# EAGLE design tc0xC_prod (EAGLE 9.6.2)

## Sheet 1 of 2
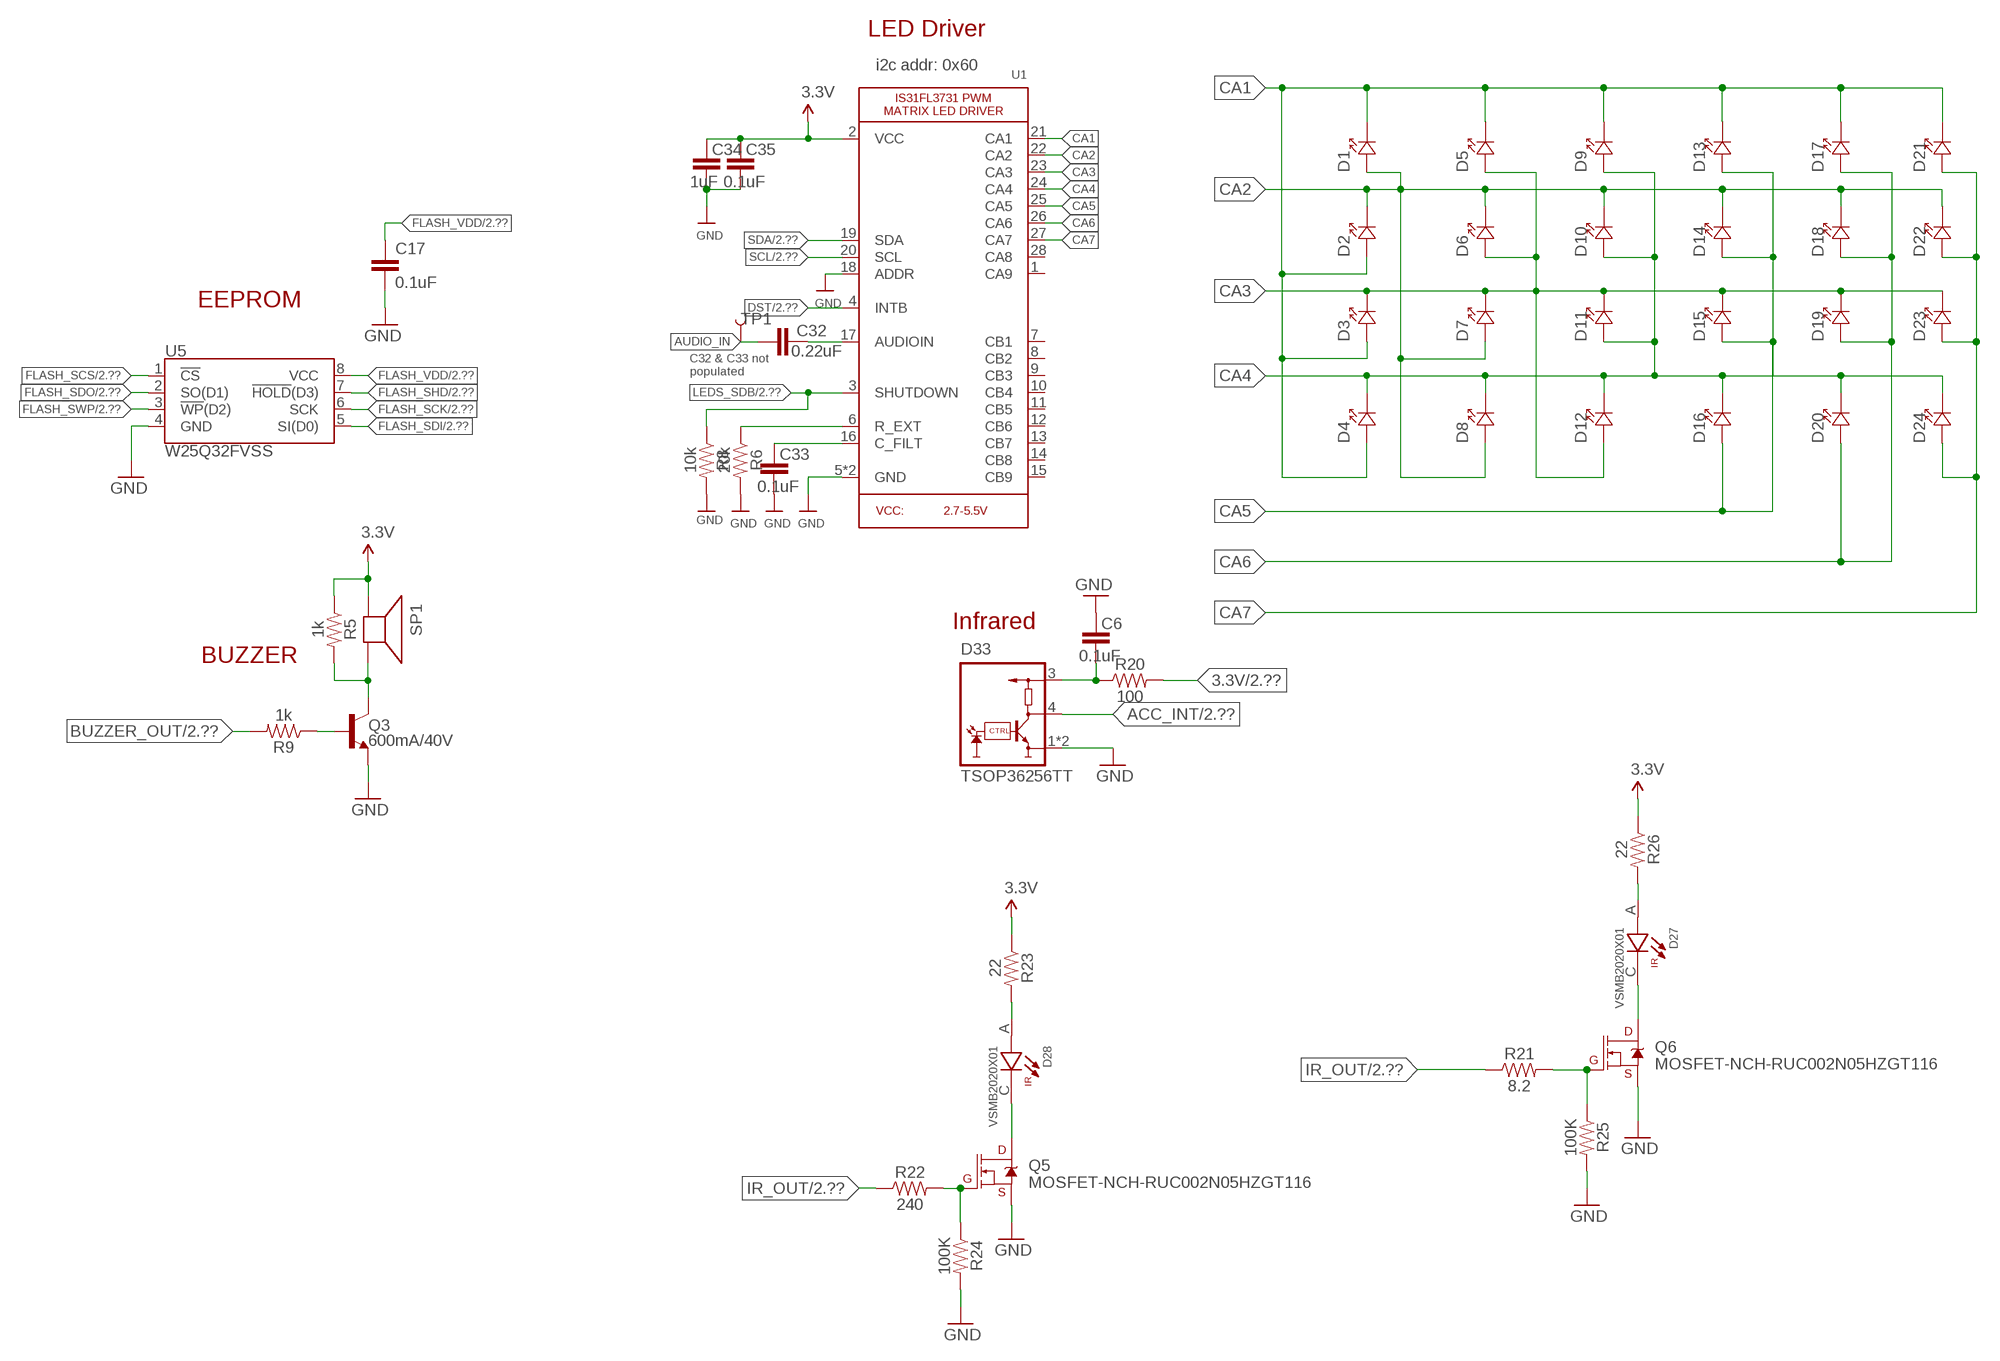
[diagram p0: schematic, sheet 1]

### Parts
C6  0.1uF  10PF-0603-50V-5%  [0603]
C17  0.1uF  0.1UF-0603-25V-(+80/-20%)  [0603]
C32  0.22uF  10PF-0603-50V-5%  [0603]
C33  0.1uF  10PF-0603-50V-5%  [0603]
C34  1uF  10PF-0603-50V-5%  [0603]
C35  0.1uF  10PF-0603-50V-5%  [0603]
D1  LED-603  [SMD-603]
D2  LED-603  [SMD-603]
D3  LED-603  [SMD-603]
D4  LED-603  [SMD-603]
D5  LED-603  [SMD-603]
D6  LED-603  [SMD-603]
D7  LED-603  [SMD-603]
D8  LED-603  [SMD-603]
D9  LED-603  [SMD-603]
D10  LED-603  [SMD-603]
D11  LED-603  [SMD-603]
D12  LED-603  [SMD-603]
D13  LED-603  [SMD-603]
D14  LED-603  [SMD-603]
D15  LED-603  [SMD-603]
D16  LED-603  [SMD-603]
D17  LED-603  [SMD-603]
D18  LED-603  [SMD-603]
D19  LED-603  [SMD-603]
D20  LED-603  [SMD-603]
D21  LED-603  [SMD-603]
D22  LED-603  [SMD-603]
D23  LED-603  [SMD-603]
D24  LED-603  [SMD-603]
D27  VSMB2020X01  [DIO_VSMB2020X01]
D28  VSMB2020X01  [DIO_VSMB2020X01]
D33  TSOP36256TT  [TSOP36256]
Q3  600mA/40V  TRANS_NPN-MMBT2222AL  [SOT23-3]
Q5  MOSFET-NCH-RUC002N05HZGT116  [SOT-23-3]
Q6  MOSFET-NCH-RUC002N05HZGT116  [SOT-23-3]
R5  1k  10KOHM-0603-1/10W-1%  [0603]
R6  20k  10KOHM-0603-1/10W-1%  [0603]
R8  10k  10KOHM-0603-1/10W-1%  [0603]
R9  1k  10KOHM-0603-1/10W-1%  [0603]
R20  100  10KOHM-0603-1/10W-1%  [0603]
R21  8.2  10KOHM-0603-1/10W-1%  [0603]
R22  240  10KOHM-0603-1/10W-1%  [0603]
R23  22  10KOHM-0603-1/10W-1%  [0603]
R24  100K  10KOHM-0603-1/10W-1%  [0603]
R25  100K  10KOHM-0603-1/10W-1%  [0603]
R26  22  10KOHM-0603-1/10W-1%  [0603]
SP1  SPEAKER/PS12  [PS12]
TP1  TEST-POINT3X5  [PAD.03X.05]
U1  IS31FL3731QFN  [QFN-28_4MM_0.4MM]
U5  W25Q32FVSS  [SOIC-8]

### Nets
3.3V: C34.1 C35.1 R5.1 R20.2 R23.1 R26.1 SP1.P$1(+) U1.2(VCC) ; also sheet 2
ACC_INT: D33.4(OUT) ; also sheet 2
AUDIO_IN: C32.1 TP1.P$1
BUZZER_OUT: R9.2 ; also sheet 2
CA1: D1.P$2(CATHODE-) D2.P$1(ANODE+) D3.P$1(ANODE+) D4.P$1(ANODE+) D5.P$2(CATHODE-) D9.P$2(CATHODE-) D13.P$2(CATHODE-) D17.P$2(CATHODE-) D21.P$2(CATHODE-) U1.21(CA1)
CA2: D1.P$1(ANODE+) D2.P$2(CATHODE-) D6.P$2(CATHODE-) D7.P$1(ANODE+) D8.P$1(ANODE+) D10.P$2(CATHODE-) D14.P$2(CATHODE-) D18.P$2(CATHODE-) D22.P$2(CATHODE-) U1.22(CA2)
CA3: D3.P$2(CATHODE-) D5.P$1(ANODE+) D6.P$1(ANODE+) D7.P$2(CATHODE-) D11.P$2(CATHODE-) D12.P$1(ANODE+) D15.P$2(CATHODE-) D19.P$2(CATHODE-) D23.P$2(CATHODE-) U1.23(CA3)
CA4: D4.P$2(CATHODE-) D8.P$2(CATHODE-) D9.P$1(ANODE+) D10.P$1(ANODE+) D11.P$1(ANODE+) D12.P$2(CATHODE-) D16.P$2(CATHODE-) D20.P$2(CATHODE-) D24.P$2(CATHODE-) U1.24(CA4)
CA5: D13.P$1(ANODE+) D14.P$1(ANODE+) D15.P$1(ANODE+) D16.P$1(ANODE+) U1.25(CA5)
CA6: D17.P$1(ANODE+) D18.P$1(ANODE+) D19.P$1(ANODE+) D20.P$1(ANODE+) U1.26(CA6)
CA7: D21.P$1(ANODE+) D22.P$1(ANODE+) D23.P$1(ANODE+) D24.P$1(ANODE+) U1.27(CA7)
DST: U1.4(INTB) ; also sheet 2
FLASH_SCK: U5.6(SCK) ; also sheet 2
FLASH_SCS: U5.1(!CS!) ; also sheet 2
FLASH_SDI: U5.5(SI(D0)) ; also sheet 2
FLASH_SDO: U5.2(SO(D1)) ; also sheet 2
FLASH_SHD: U5.7(!HOLD!(D3)) ; also sheet 2
FLASH_SWP: U5.3(!WP!(D2)) ; also sheet 2
FLASH_VDD: C17.1 U5.8(VCC) ; also sheet 2
GND: C6.1 C17.2 C33.2 C34.2 C35.2 D33.1(GND) D33.2(GND) Q3.2(E) Q5.2(S) Q6.2(S) R6.2 R8.2 R24.2 R25.2 U1.5(GND) U1.18(ADDR) U1.THERMAL(GND) U5.4(GND) ; also sheet 2
IR_OUT: R21.1 R22.1 ; also sheet 2
LEDS_SDB: R8.1 U1.3(SHUTDOWN) ; also sheet 2
N$1: C33.1 U1.16(C_FILT)
N$2: R6.1 U1.6(R_EXT)
N$3: Q3.3(C) R5.2 SP1.P$2(-)
N$5: Q6.1(G) R21.2 R25.1
N$6: Q5.1(G) R22.2 R24.1
N$11: C32.2 U1.17(AUDIOIN)
N$17: C6.2 D33.3(VS) R20.1
N$19: D28.C Q5.3(D)
N$20: D28.A R23.2
N$21: D27.C Q6.3(D)
N$22: D27.A R26.2
N$26: Q3.1(B) R9.1
SCL: U1.20(SCL) ; also sheet 2
SDA: U1.19(SDA) ; also sheet 2
Unconnected: U1.1(CA9) U1.7(CB1) U1.8(CB2) U1.9(CB3) U1.10(CB4) U1.11(CB5) U1.12(CB6) U1.13(CB7) U1.14(CB8) U1.15(CB9) U1.28(CA8)

### Notes on the sheet
- LED Driver
- i2c addr: 0x60
- EEPROM
- C32 & C33 not
  populated
- Infrared
- BUZZER

## Sheet 2 of 2
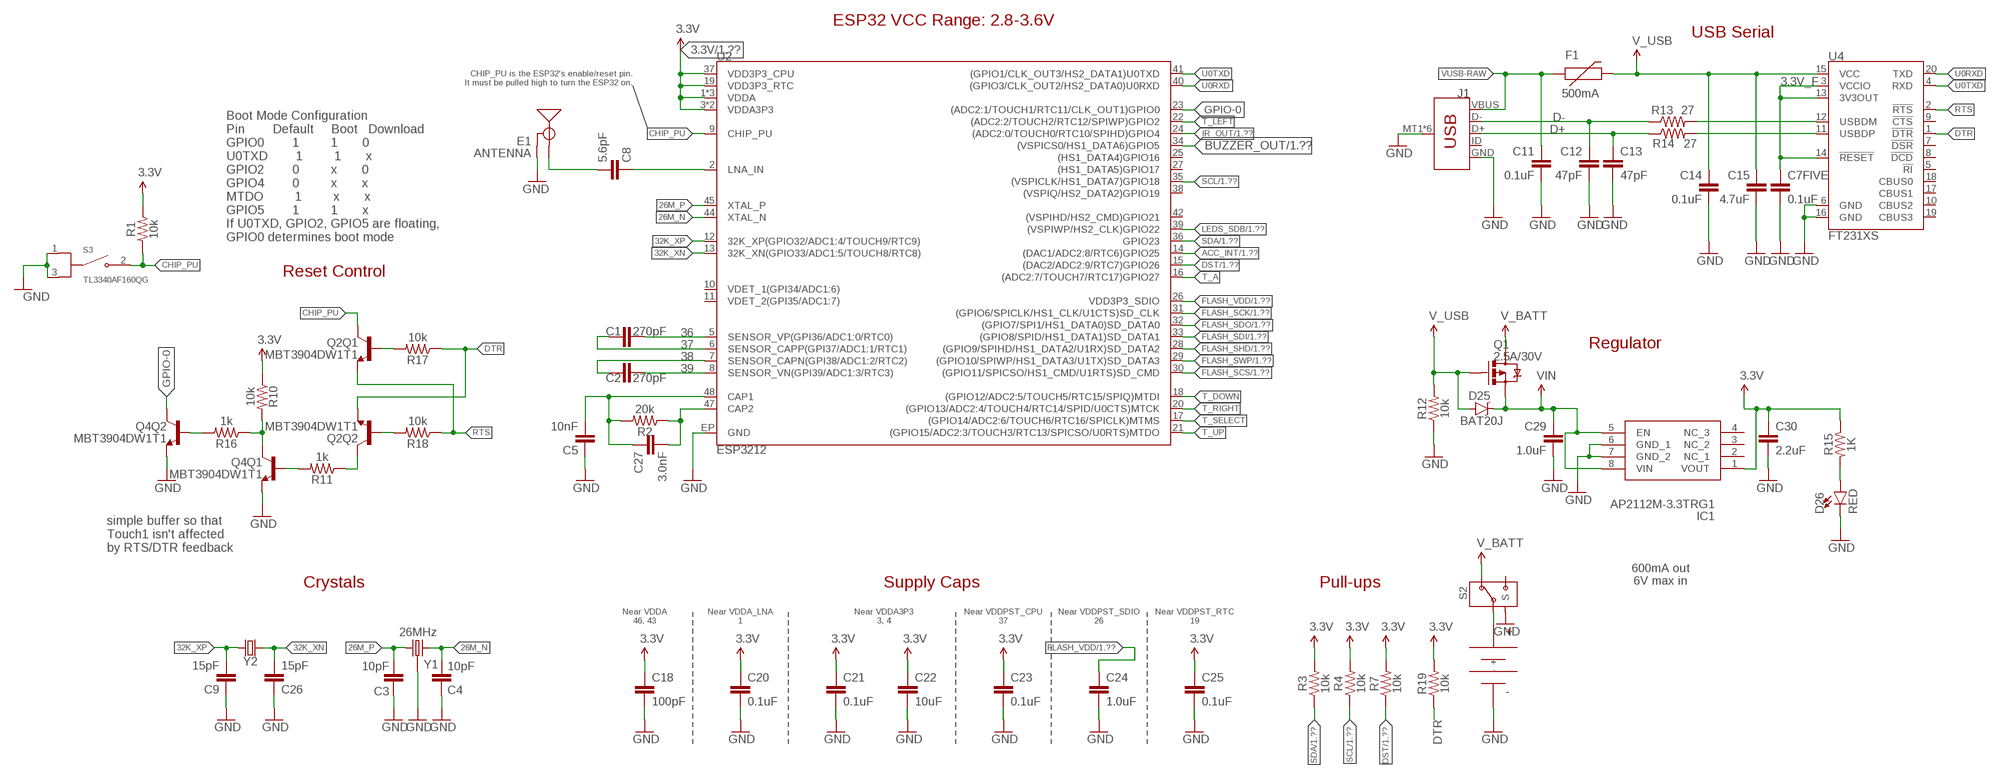
[diagram p1: schematic, sheet 2]

### Parts
C1  270pF  270PF-50V-5%(0603)  [0603]
C2  270pF  270PF-50V-5%(0603)  [0603]
C3  10pF  10PF-0603-50V-5%  [0603]
C4  10pF  10PF-0603-50V-5%  [0603]
C5  10nF  10NF-0603-50V-10%  [0603]
C7FIVE  0.1uF  0.1UF-0603-25V-(+80/-20%)  [0603]
C8  5.6pF  5.6PF-50V-5%(0603)  [0603]
C9  15pF  15PF-0603-50V-5%  [0603]
C11  0.1uF  0.1UF-0603-25V-(+80/-20%)  [0603]
C12  47pF  47PF-0603-50V-5%  [0603]
C13  47pF  47PF-0603-50V-5%  [0603]
C14  0.1uF  0.1UF-0603-25V-(+80/-20%)  [0603]
C15  4.7uF  0.1UF-0603-25V-(+80/-20%)  [0603]
C18  100pF  100PF-0603-50V-5%  [0603]
C20  0.1uF  0.1UF-0603-25V-(+80/-20%)  [0603]
C21  0.1uF  0.1UF-0603-25V-(+80/-20%)  [0603]
C22  10uF  10UF-0603-6.3V-20%  [0603]
C23  0.1uF  0.1UF-0603-25V-(+80/-20%)  [0603]
C24  1.0uF  1.0UF-0603-16V-10%  [0603]
C25  0.1uF  0.1UF-0603-25V-(+80/-20%)  [0603]
C26  15pF  15PF-0603-50V-5%  [0603]
C27  3.0nF  3.0NF-0603-50V-5%  [0603]
C29  1.0uF  1.0UF-0805-25V-(+80/-20%)  [0805]
C30  2.2uF  2.2UF-0603-10V-20%  [0603]
D25  BAT20J  DIODE-SCHOTTKY-BAT20J  [SOD-323]
D26  RED  LED-RED0603  [LED-0603@1]
E1  ANTENNA  ANTENNATRACE-TUNED  [TRACE_ANTENNA_2.4GHZ_25.7MM_TUNED]
F1  500mA  PTCSMD  [PTC-1206]
G2  KEYSTONE_2479  [KEYSTONE_2479]
IC1  AP2112M-3.3TRG1  [SOIC127P600X170-8N]
J1  USB_MICRO-B  [USB-MICROB-10118192]
Q1  2.5A/30V  MOSFET-PCHANNELDMG2307L  [SOT23-3@1]
Q2  MBT3904DW1T1  [SC70-6]
Q4  MBT3904DW1T1  [SC70-6]
R1  10k  10KOHM-1/10W-1%(0603)0603  [0603]
R2  20k  20KOHM-0603-1/10W-1%  [0603]
R3  10k  10KOHM-0603-1/10W-1%  [0603]
R4  10k  10KOHM-0603-1/10W-1%  [0603]
R7  10k  10KOHM-0603-1/10W-1%  [0603]
R10  10k  10KOHM-0603-1/10W-1%  [0603]
R11  1k  10KOHM-0603-1/10W-1%  [0603]
R12  10k  10KOHM-0603-1/10W-1%  [0603]
R13  27  27OHM1/10W1%(0603)0603-RES  [0603]
R14  27  27OHM1/10W1%(0603)0603-RES  [0603]
R15  1K  1KOHM-1/10W-1%(0603)  [0603]
R16  1k  10KOHM-0603-1/10W-1%  [0603]
R17  10k  10KOHM-0603-1/10W-1%  [0603]
R18  10k  10KOHM-0603-1/10W-1%  [0603]
R19  10k  10KOHM-0603-1/10W-1%  [0603]
S2  CUS-12B  [CUS-12_SPDT]
S3  TL3340AF160QG  [SW_TL3340AF160QG]
U2  ESP3212  [QFN48-0.4MM]
U4  FT231XS  [SSOP20_L]
Y1  26MHz  CRYSTAL-GROUNDED3.2X2.5  [CRYSTAL-SMD-3.2X2.5]
Y2  32.768kHz  FC-12M  [FC-12M]

### Nets
3.3V: C18.1 C20.1 C21.1 C22.1 C23.1 C25.1 C30.1 IC1.1(VOUT) R1.2 R3.2 R4.2 R7.2 R10.1 R15.1 R19.2 U2.1(VDDA) U2.3(VDDA3P3) U2.4(VDDA3P3) U2.19(VDD3P3_RTC) U2.37(VDD3P3_CPU) U2.43(VDDA) U2.46(VDDA) ; also sheet 1
3.3V_F: C7FIVE.1 U4.3(VCCIO) U4.13(3V3OUT) U4.14(!RESET)
26M_N: C4.2 U2.44(XTAL_N) Y1.3
26M_P: C3.2 U2.45(XTAL_P) Y1.1
32K_XN: C26.2 U2.13(32K_XN(GPIO33/ADC1:5/TOUCH8/RTC8)) Y2.2
32K_XP: C9.2 U2.12(32K_XP(GPIO32/ADC1:4/TOUCH9/RTC9)) Y2.1
36: C1.2 U2.5(SENSOR_VP(GPI36/ADC1:0/RTC0))
37: C1.1 U2.6(SENSOR_CAPP(GPI37/ADC1:1/RTC1))
38: C2.1 U2.7(SENSOR_CAPN(GPI38/ADC1:2/RTC2))
39: C2.2 U2.8(SENSOR_VN(GPI39/ADC1:3/RTC3))
ACC_INT: U2.14((DAC1/ADC2:8/RTC6)GPIO25) ; also sheet 1
BUZZER_OUT: U2.34((VSPICS0/HS1_DATA6)GPIO5) ; also sheet 1
CAP_10N: C5.2 C27.1 R2.2 U2.48(CAP1)
CHIP_PU: Q2.3(Q1:C) R1.1 S3.2(NO) U2.9(CHIP_PU)
D+: C13.1 J1.D+ R14.1
D-: C12.1 J1.D- R13.1
DST: R7.1 U2.15((DAC2/ADC2:9/RTC7)GPIO26) ; also sheet 1
DTR: Q2.1(Q2:E) R17.1 R19.1 U4.1(!DTR)
FLASH_SCK: U2.31((GPIO6/SPICLK/HS1_CLK/U1CTS)SD_CLK) ; also sheet 1
FLASH_SCS: U2.30((GPIO11/SPICSO/HS1_CMD/U1RTS)SD_CMD) ; also sheet 1
FLASH_SDI: U2.33((GPIO8/SPID/HS1_DATA1)SD_DATA1) ; also sheet 1
FLASH_SDO: U2.32((GPIO7/SPI1/HS1_DATA0)SD_DATA0) ; also sheet 1
FLASH_SHD: U2.28((GPIO9/SPIHD/HS1_DATA2/U1RX)SD_DATA2) ; also sheet 1
FLASH_SWP: U2.29((GPIO10/SPIWP/HS1_DATA3/U1TX)SD_DATA3) ; also sheet 1
FLASH_VDD: C24.1 U2.26(VDD3P3_SDIO) ; also sheet 1
GND: C3.1 C4.1 C5.1 C7FIVE.2 C9.1 C11.2 C12.2 C13.2 C14.2 C15.2 C18.2 C20.2 C21.2 C22.2 C23.2 C24.2 C25.2 C26.1 C29.2 C30.2 D26.C E1.GND E1.GND2(GND) G2.- IC1.6(GND_1) IC1.7(GND_2) J1.GND J1.MT1(SHIELD) J1.MT2(SHIELD) J1.MT3(SHIELD) J1.MT4(SHIELD) J1.P$1(SHIELD) J1.P$2(SHIELD) Q4.1(Q2:E) Q4.4(Q1:E) R12.1 S2.P$4(S) S2.P$5(S) S2.P$6(S) S2.P$7(S) S3.1(COM_1) S3.3(COM_2) U2.EP(GND) U4.6(GND) U4.16(GND) Y1.2(GND) Y1.4(GND) ; also sheet 1
GPIO-0: Q4.6(Q2:C) U2.23((ADC2:1/TOUCH1/RTC11/CLK_OUT1)GPIO0)
IR_OUT: U2.24((ADC2:0/TOUCH0/RTC10/SPIHD)GPIO4) ; also sheet 1
LEDS_SDB: U2.39((VSPIWP/HS2_CLK)GPIO22) ; also sheet 1
LNA_IN: C8.1 U2.2(LNA_IN)
N$4: C27.2 R2.1 U2.47(CAP2)
N$7: R13.2 U4.12(USBDM)
N$8: R14.2 U4.11(USBDP)
N$9: Q4.2(Q2:B) R16.2
N$10: Q2.5(Q1:B) R17.2
N$12: Q2.2(Q2:B) R18.2
N$13: Q4.3(Q1:C) R10.2 R16.1
N$14: Q4.5(Q1:B) R11.2
N$15: Q2.6(Q2:C) R11.1
N$16: G2.+ S2.P$2
N$18: D26.A R15.2
RTS: Q2.4(Q1:E) R18.1 U4.2(!RTS)
SCL: R4.1 U2.35((VSPICLK/HS1_DATA7)GPIO18) ; also sheet 1
SDA: R3.1 U2.36(GPIO23) ; also sheet 1
T_A: U2.16((ADC2:7/TOUCH7/RTC17)GPIO27)
T_DOWN: U2.18((GPIO12/ADC2:5/TOUCH5/RTC15/SPIQ)MTDI)
T_LEFT: U2.22((ADC2:2/TOUCH2/RTC12/SPIWP)GPIO2)
T_RIGHT: U2.20((GPIO13/ADC2:4/TOUCH4/RTC14/SPID/U0CTS)MTCK)
T_SELECT: U2.17((GPIO14/ADC2:6/TOUCH6/RTC16/SPICLK)MTMS)
T_UP: U2.21((GPIO15/ADC2:3/TOUCH3/RTC13/SPICSO/U0RTS)MTDO)
TRACE_ANT: C8.2 E1.ANT(SIGNAL)
U0RXD: U2.40((GPIO3/CLK_OUT2/HS2_DATA0)U0RXD) U4.20(TXD)
U0TXD: U2.41((GPIO1/CLK_OUT3/HS2_DATA1)U0TXD) U4.4(RXD)
V_BATT: Q1.3(D) S2.P$1
V_USB: C14.1 C15.1 D25.A F1.2 Q1.1(G) R12.2 U4.15(VCC)
VIN: C29.1 D25.C IC1.5(EN) IC1.8(VIN) Q1.2(S)
VUSB-RAW: C11.1 F1.1 J1.VBUS
Unconnected: IC1.2(NC_1) IC1.3(NC_2) IC1.4(NC_3) J1.ID S2.P$3 U2.10(VDET_1(GPI34/ADC1:6)) U2.11(VDET_2(GPI35/ADC1:7)) U2.25((HS1_DATA4)GPIO16) U2.27((HS1_DATA5)GPIO17) U2.38((VSPIQ/HS2_DATA2)GPIO19) U2.42((VSPIHD/HS2_CMD)GPIO21) U4.5(!RI) U4.7(!DSR) U4.8(!DCD) U4.9(!CTS) U4.10(CBUS2) U4.17(CBUS1) U4.18(CBUS0) U4.19(CBUS3)

### Notes on the sheet
- ESP32 VCC Range: 2.8-3.6V
- USB Serial
- CHIP_PU is the ESP32's enable/reset pin.
  It must be pulled high to turn the ESP32 on.
- Boot Mode Configuration
  Pin        Default     Boot   Download
  GPIO0        1         1       0
  U0TXD        1         1       x
  GPIO2        0         x       0
  GPIO4        0         x       x
  MTDO         1         x       x
  GPIO5        1         1       x
  If U0TXD, GPIO2, GPIO5 are floating, 
  GPIO0 determines boot mode
- Reset Control
- Regulator
- simple buffer so that
  Touch1 isn't affected
  by RTS/DTR feedback
- 600mA out
  6V max in
- Crystals | Supply Caps | Pull-ups
- Near VDDA
  46, 43
- Near VDDA_LNA
  1
- Near VDDA3P3
  3, 4
- Near VDDPST_CPU
  37
- Near VDDPST_SDIO
  26
- Near VDDPST_RTC
  19

## Library data of the parts
C1 C2 = esp32-thing-temp:270PF-50V-5%(0603): CAP-13339; PROD_ID: CAP-13339
C3 C4 = SparkFun-Capacitors:10PF: 10pF ceramic capacitors A capacitor is a passive two-terminal electrical component used to store electrical energy temporarily in an electric field.; PROD_ID: CAP-11812
C5 = SparkFun-Capacitors:10NF: 0.01uF/10nF/10,000pF ceramic capacitors A capacitor is a passive two-terminal electrical component used to store electrical energy temporarily in an electric field. CAP-09321; PROD_ID: CAP-00867
C6 C32-C35 = SparkFun-Capacitors:10PF: 10pF ceramic capacitors A capacitor is a passive two-terminal electrical component used to store electrical energy temporarily in an electric field.; PROD_ID: CAP-11812; VALUE: 10pF
C7FIVE C11 C14 C17 C20 C21 C23 C25 = SparkFun-Capacitors:0.1UF: 0.1µF ceramic capacitors A capacitor is a passive two-terminal electrical component used to store electrical energy temporarily in an electric field.; PROD_ID: CAP-00810
C8 = esp32-thing-temp:5.6PF-50V-5%(0603): CAP-12456; PROD_ID: CAP-12456
C9 C26 = SparkFun-Capacitors:15PF: 15pF ceramic capacitors A capacitor is a passive two-terminal electrical component used to store electrical energy temporarily in an electric field.; PROD_ID: CAP-07881
C12 C13 = SparkFun-Capacitors:47PF: 47pF ceramic capacitors A capacitor is a passive two-terminal electrical component used to store electrical energy temporarily in an electric field.; PROD_ID: CAP-08913
C15 = SparkFun-Capacitors:0.1UF: 0.1µF ceramic capacitors A capacitor is a passive two-terminal electrical component used to store electrical energy temporarily in an electric field.; PROD_ID: CAP-00810; VALUE: 0.1uF
C18 = SparkFun-Capacitors:100PF: 100pF/0.1nF ceramic capacitors A capacitor is a passive two-terminal electrical component used to store electrical energy temporarily in an electric field.; PROD_ID: CAP-07883
C22 = SparkFun-Capacitors:10UF: 10.0µF ceramic capacitors A capacitor is a passive two-terminal electrical component used to store electrical energy temporarily in an electric field.; PROD_ID: CAP-11015
C24 = SparkFun-Capacitors:1.0UF: 1µF ceramic capacitors A capacitor is a passive two-terminal electrical component used to store electrical energy temporarily in an electric field.; PROD_ID: CAP-00868
C27 = esp32-thing-temp:3.0NF: 3.0nF (3nF, 3000pF) ceramic capacitors A capacitor is a passive two-terminal electrical component used to store electrical energy temporarily in an electric field.; PROD_ID: CAP-13515
C29 = SparkFun-Capacitors:1.0UF: 1µF ceramic capacitors A capacitor is a passive two-terminal electrical component used to store electrical energy temporarily in an electric field.; PROD_ID: CAP-11625
C30 = SparkFun-Capacitors:2.2UF: 2.2µF ceramic capacitors A capacitor is a passive two-terminal electrical component used to store electrical energy temporarily in an electric field.; PROD_ID: CAP-07888
D1-D24 = Rob-Diodes:LED
D25 = SparkFun-DiscreteSemi:DIODE-SCHOTTKY: Schottky diodes in SFE's production catalog BAT20J 1A 23V 0.62Vf RB751 120mA 40V 0.37Vf PMEG4005EJ 0.5A 40V 0.42Vf MBRA140 1A 40V 0.5Vf B340A 3A 40V SMA; PROD_ID: DIO-11623
D26 = SparkFun-LED:LED-RED: Red SMD LED Used in manufacturing of most products at SparkFun 0603 - SMD 0603 package Forward Voltage: 1.9V Forward Current: 20mA Datasheet: [Product Link] <http://docs.avagotech.com/docs/AV02-0551EN> 0603 SMART - SMD 0603 SMART package ( more efficient and expensive) Forward Voltage: 1.8V Forward Current: 20mA Datasheet: [Product Link] <http://www.osram-os.com/Graphics/XPic2/00077099_0.pdf> 1206 - SMD 1206 package Forward Voltage: 2V Forward Current: 20mA Datasheet: [Product Link] <https://www.sparkfun.com/datasheets/DevTools/LilyPad/Q150OVS4.pdff> 1206 LilyPad - SMD 1206 LilyPad package Forward Voltage: 2V Forward Current: 20mA Datasheet: [Product Link] <https://www.sparkfun.com/datasheets/DevTools/LilyPad/Q150OVS4.pdf>; PROD_ID: DIO-00819
D27 D28 = VSMB2020X01:VSMB2020X01: 940 nm 100 mA ±12° Surface Mount High Speed Infrared Emitting Diode T&R Check availability <https://pricing.snapeda.com/parts/VSMB2020X01/Vishay%20Semiconductors/view-part?ref=eda>; AVAILABILITY: In Stock; DESCRIPTION: Infrared (IR) Emitter 940nm 1.35V 100mA 20mW/sr @ 100mA 24° 2-SMD, Gull Wing; MF: Vishay Semiconductors; MP: VSMB2020X01; PACKAGE: None; PRICE: None; PURCHASE-URL: https://pricing.snapeda.com/search/part/VSMB2020X01/?ref=eda
D33 = TSOP36256:TSOP36256: Récepteur Infrarouge 56khz 35m 45° Doc constructeur <http://geii/magasin/pdf/TSOP36256.pdf> GEII/IUT ANGERS Check availability <https://pricing.snapeda.com/parts/TSOP36256/Vishay%20Semiconductors/view-part?ref=eda>; AVAILABILITY: In Stock; DESCRIPTION: IR RCVR, 35M, 0.12MW/M2, TOP/SIDE SMD; Carrier Frequency:56kHz; IR Receiver Mounting Style:Top or Side View Surface Mount; Remote Control Code:NEC (Repetitive Pulse), NEC (Repetitive Data), Toshiba Micom Format, Sharp, RC-5, RC-6, R-2000, Sony; Transmission Range:35m; Automatic Gain Control (AGC) Type:AGC2; Detection Threshold / Sensitivity:0.12mW/m²; Directivity:45°; Supply Voltage Max:5.5V; Supply Voltage Min:2.7V; Operating Temperature Min:-25°C; Operating Temperature Max:85°C; Supply Current:1.3mA; Product Range:-; No. of Pins:4Pins; Operating Temperature Range:-25°C to +85°C; Supply Voltage Range:2.7V to 5.5V; Viewing Angle:45°; MF: Vishay Semiconductors; MP: TSOP36256; PACKAGE: None; PRICE: None; PURCHASE-URL: https://pricing.snapeda.com/search/part/TSOP36256/?ref=eda
E1 = esp32-thing-temp:ANTENNA: Chip antenna Chip antenna with ground or secondary connection. Common with larger metal RF connectors.
F1 = SparkFun-PowerIC:PTC: Resettable Fuse PTC Resettable Fuse. Spark Fun Electronics SKU : COM-08357; PROD_ID: RES-11150
G2 = keystone:KEYSTONE_2479
IC1 = AP2112M-3.3TRG1:AP2112M-3.3TRG1: LDO Voltage Regulators LDO CMOS HiCurr Source: Datasheet <https://www.diodes.com/assets/Datasheets/AP2112.pdf>; ARROW_PART_NUMBER: AP2112M-3.3TRG1; ARROW_PRICE-STOCK: https://www.arrow.com/en/products/ap2112m-3.3trg1/diodes-incorporated?region=nac; DESCRIPTION: LDO Voltage Regulators LDO CMOS HiCurr; HEIGHT: 1.7mm; MANUFACTURER_NAME: Diodes Inc.; MANUFACTURER_PART_NUMBER: AP2112M-3.3TRG1; MOUSER_PART_NUMBER: 621-AP2112M-3.3TRG1; MOUSER_PRICE-STOCK: https://www.mouser.co.uk/ProductDetail/Diodes-Incorporated/AP2112M-33TRG1?qs=5V6w%252Be2aIqa1YM8VADFBsQ%3D%3D
J1 = SparkFun-Connectors-new:USB_MICRO-B: USB Type Micro-B Connector Male/female and PTH/SMT variants SparkFun Products: SparkFun microB USB Breakout <https://www.sparkfun.com/products/12035> SparkFun USB microB Plug Breakout <https://www.sparkfun.com/products/10031> SparkFun ESP8266 Thing <https://www.sparkfun.com/products/13231>
Q1 = SparkFun-DiscreteSemi:MOSFET-PCHANNEL: Generic PMOSFET IRLML2244 - TRANS-11153 (SOT-23 -20V -4.3A) (1.Gate 2.Source 3.Drain) FQP27P06 - COM-10349 <http://www.sparkfun.com/products/10349> (TO-220 -60V -27A) (1.Gate 2.Source 3.Drain); PROD_ID: TRANS-11308
Q2 Q4 = esp32-thing-temp:MBT3904DW1T1: MBT3904DW1 Dual NPN Transistors The MBT3904W1 puts two general purpose 3904 NPN transistors in a single package. Datasheet <http://www.onsemi.com/pub_link/Collateral/MBT3904DW1T1-D.PDF>; PROD_ID: TRANS-13337
Q3 = SparkFun-DiscreteSemi:TRANS_NPN: NPN transistor Current controlled devices typically used to amplify current or used as a switch. BC547 - COM-08928 <http://www.sparkfun.com/products/8928> (TO-92 45V 100mA) (1.Collector 2.Base 3.Emitter) 2N3904 - COM-00521 <http://www.sparkfun.com/products/521> (TO-92 40V 200mA) (1.Emitter 2.Base 3.Collector) P2N2222A - COM-12852 <http://www.sparkfun.com/products/12852> (TO-92 40V 600mA) (1.Collector 2.Base 3.Emitter); PROD_ID: TRANS-08049
Q5 Q6 = Rob-DiscreteSemi:MOSFET-NCH
R1 = SparkFun-Resistors:10KOHM-1/10W-1%(0603): RES-00824; PROD_ID: RES-00824; VALUE: 10K
R2 = SparkFun-Resistors:20KOHM: 20kΩ resistor A resistor is a passive two-terminal electrical component that implements electrical resistance as a circuit element. Resistors act to reduce current flow, and, at the same time, act to lower voltage levels within circuits. - Wikipedia; PROD_ID: RES-09383
R3 R4 R7 R8 R10 R12 R17-R19 = SparkFun-Resistors:10KOHM: 10kΩ resistor A resistor is a passive two-terminal electrical component that implements electrical resistance as a circuit element. Resistors act to reduce current flow, and, at the same time, act to lower voltage levels within circuits. - Wikipedia; PROD_ID: RES-00824
R5 R6 R9 R11 R16 R20-R26 = SparkFun-Resistors:10KOHM: 10kΩ resistor A resistor is a passive two-terminal electrical component that implements electrical resistance as a circuit element. Resistors act to reduce current flow, and, at the same time, act to lower voltage levels within circuits. - Wikipedia; PROD_ID: RES-00824; VALUE: 10k
R13 R14 = SparkFun-Resistors:27OHM1/10W1%(0603): RES-09334; PROD_ID: RES-09334
R15 = SparkFun-Resistors:1KOHM-1/10W-1%(0603): RES-07856; PROD_ID: RES-07856
S2 = IDEO-Switches:CUS-12B
S3 = TL3340AF160QG:TL3340AF160QG: Check availability <https://pricing.snapeda.com/parts/TL3340AF160QG/E-Switch/view-part?ref=eda> Check availability <https://pricing.snapeda.com/parts/TL3340AF160QG/E-Switch/view-part?ref=eda>; AVAILABILITY: In Stock; DESCRIPTION: Tactile Switch SPST-NO Side Actuated Surface Mount, Right Angle; MF: E-Switch; MP: TL3340AF160QG; PACKAGE: None; PRICE: None; PURCHASE-URL: https://pricing.snapeda.com/search/part/TL3340AF160QG/?ref=eda
SP1 = adafruit:SPEAKER: SPEAKER Source: Buerklin Added PS12 (for part # PS1240 piezo) http://www.ladyada.net/library/pcb/eaglelibrary.html
TP1 = SparkFun-Connectors:TEST-POINT: SparkFun Test Points Bare copper test points for troubleshooting or In-Circuit-Testing. These are used by our Production team for verifying production board runs using pogo-pins on test beds. SparkFun Products: SparkFun LSM9DS1 Breakout <https://www.sparkfun.com/products/13284> SparkFun PSOC <https://www.sparkfun.com/products/13714> SparkFun Load Cell Amplifier <https://www.sparkfun.com/products/13879>
U1 = IDEO-ICs:IS31FL3731: IS31FL3731 PWM LED Matrix Driver
U2 = esp32-thing-temp:ESP3212; PROD_ID: IC-13338
U4 = SparkFun-DigitalIC:FT231X: FTDI FT231X Full Speed USB to Full-handshake UART This USB2.0 Full Speed IC offers a compact bridge to full handshake UART interfaces. The device is a UART, capable of operating up to 3MBaud, with low power consumption (8mA). The FT231X includes the complete FT-X series feature set and enables USB to be added into a system design quickly and easily over a UART interface.; PROD_ID: IC-11524
U5 = SparkFun-DigitalIC:W25Q32FV: Winbond W25Q32FV 32Mbit (4MB) Flash The W25Q32FV support the standard Serial Peripheral Interface (SPI), Dual/Quad I/O SPI as well as 2-clocks instruction cycle Quad Peripheral Interface (QPI). Datasheet <http://www.winbond.com/resource-files/w25q32fv%20revh%20091613.pdf>; PROD_ID: IC-13229
Y1 = things:CRYSTAL-GROUNDED; PROD_ID: XTAL-12454
Y2 = crystal:FC-12M: kHz RANGE CRYSTAL UNIT LOW PROFILE SMD Source: Epson Toyocom FC-12M.pdf

## Board
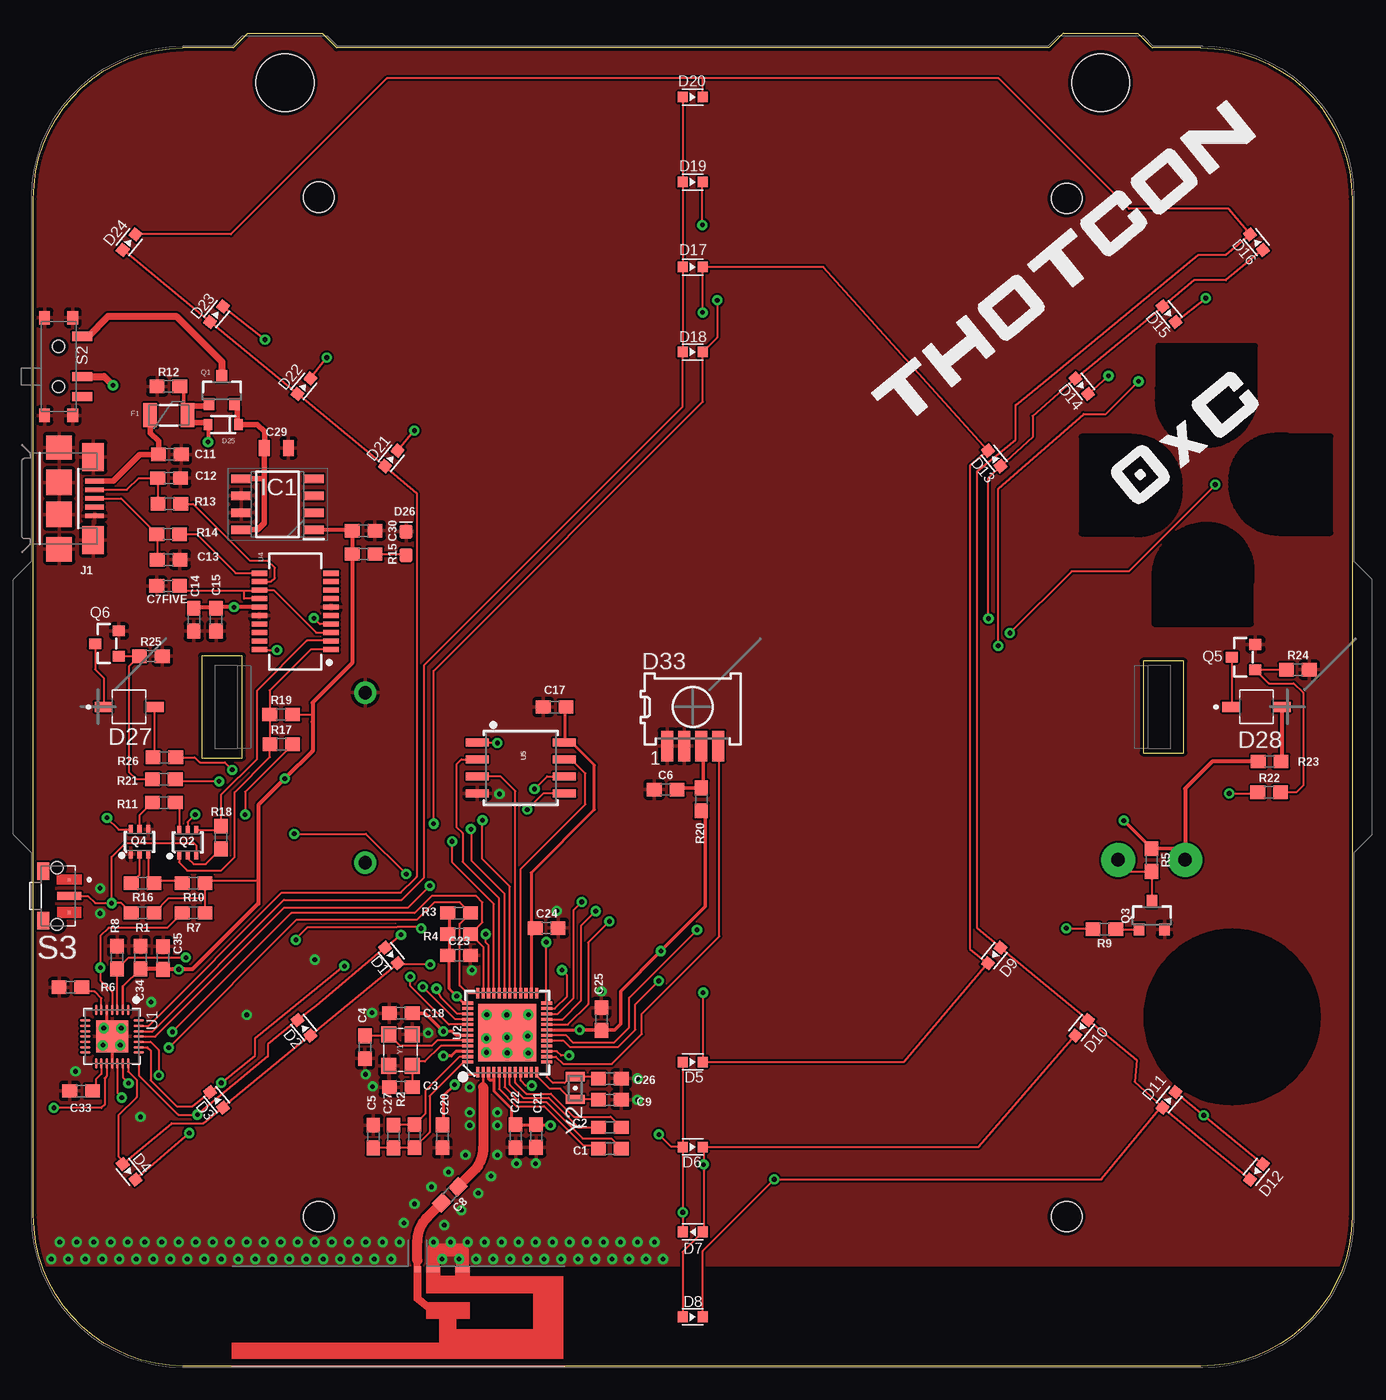
[diagram p2: board, top side]
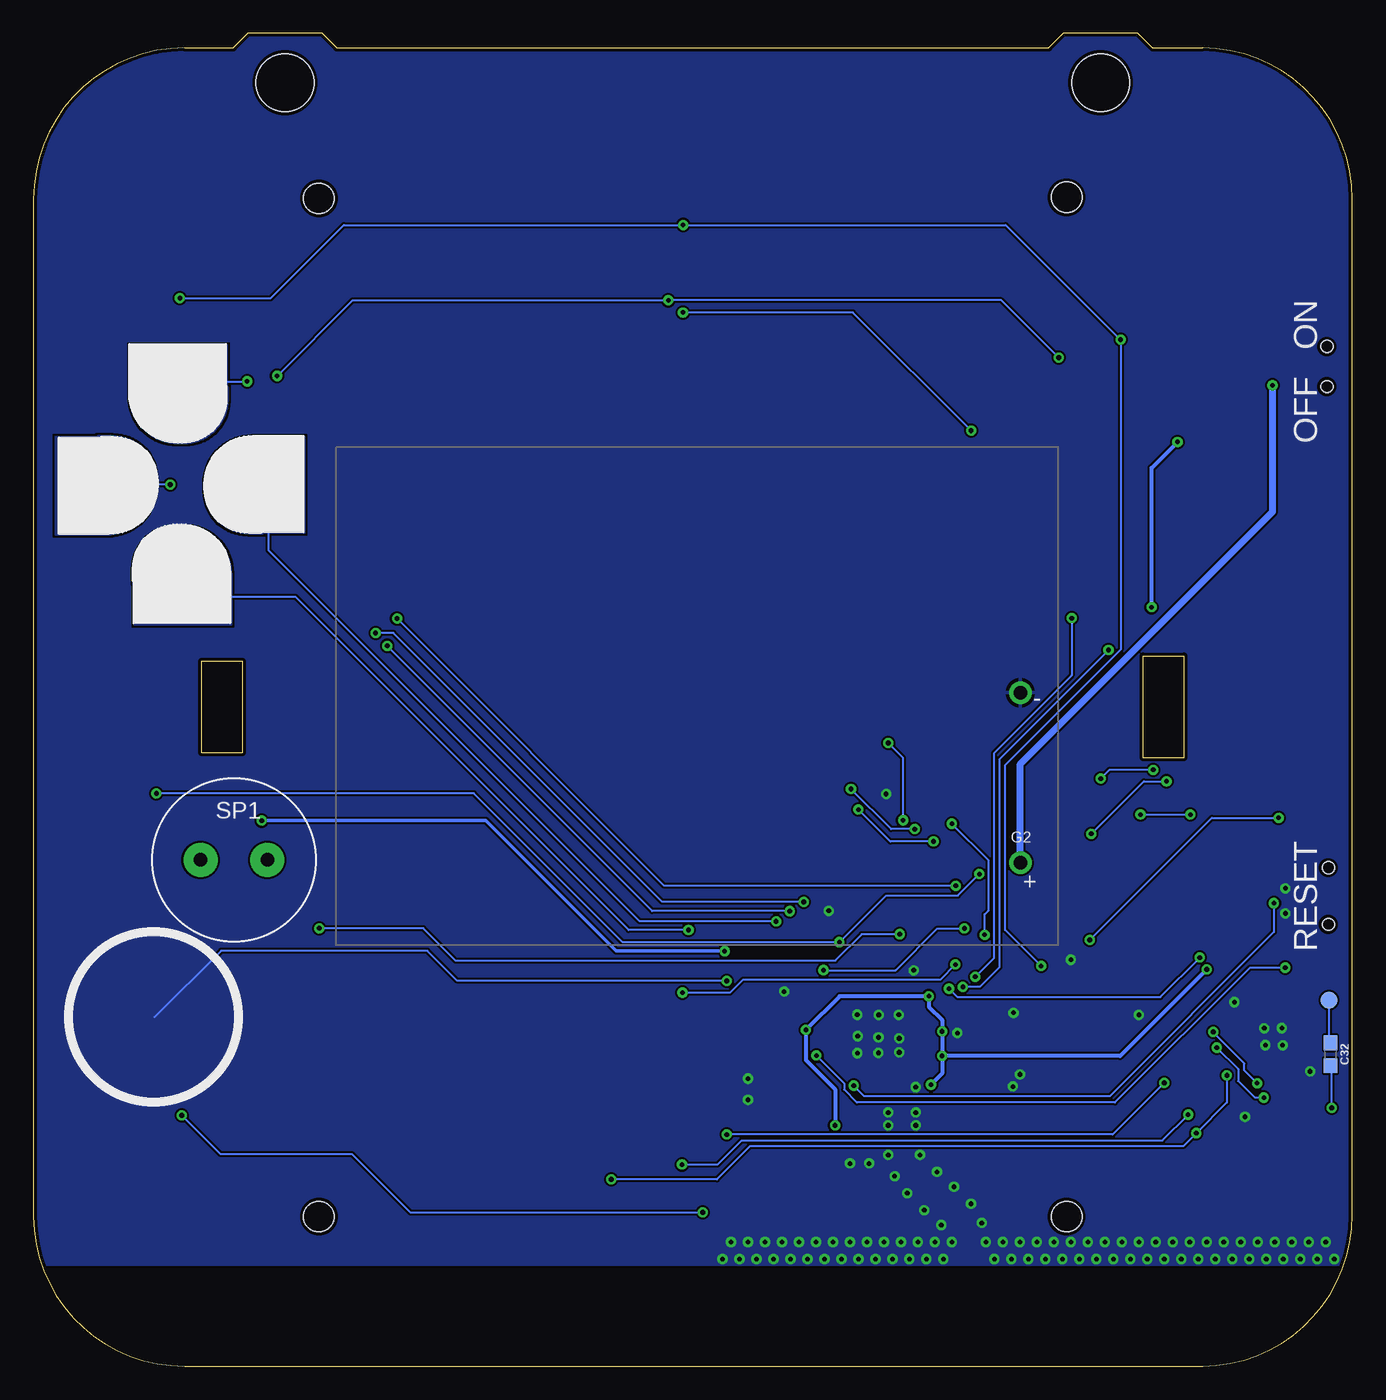
[diagram p3: board, bottom side, seen from below]

Size 98.55 x 99.63 mm. Coordinates in mm from the lower left corner, seen from the top.
Outline: 0,87.25 arc-90 11.18,98.55 14.93,98.55 16.02,99.63 21.58,99.63 22.66,98.55 75.89,98.55 76.97,99.63 82.54,99.63 83.62,98.55 87.25,98.55 arc-90 98.55,87.25 98.55,11.18 arc-90 87.25,0 11.18,0 arc-90 0,11.3 0,87.25
Outline: 82.93,45.85 85.98,45.85 85.98,52.7 82.93,52.7 82.93,45.85
Outline: 12.57,45.47 15.62,45.47 15.62,53.09 12.57,53.09 12.57,45.47
Copper layers (1*16): Top 0.035mm / dielectric 1.5mm / Bottom 0.035mm
Design rules "default *": minimum track width 6mil, minimum drill 0.35mm, track to track 6mil, track to pad 6mil, pad to pad 6mil, via to via 6mil, smd to smd 6mil, copper to edge 10mil, drill to drill 6mil, minimum pad ring 10mil, minimum via ring 8mil, stop-mask expansion 4mil, vias tented up to drill 0mil, thermal gap 10mil
Holes 2.29 mm at 21.34,87.38 77.22,87.3 77.22,11.18 21.34,11.18
Holes 4.32 mm at 18.8,95.95 79.76,95.95
tKeepout: area 97.5,35.7 to 98.8,37.9; area 19.4,85.5 to 23.2,89.3; area 19.4,9.3 to 23.2,13.1; area 75.3,9.3 to 79.1,13.1; area 75.3,85.5 to 79.1,89.3; area 46.1,91.7 to 49.3,98.1; area 49.3,91.7 to 52.4,98.1; area 46.1,85.4 to 49.3,91.7; area 49.3,85.4 to 52.4,91.7; area 46.1,79 to 49.3,85.4; area 49.3,79 to 52.4,85.4; area 46.1,72.7 to 49.3,79; 41 more areas
tRestrict: area 83.2,19.7 to 95.9,32.4; area 83.8,55.5 to 91,62.9; area 78.3,62.2 to 85.7,69.5; area 84,68.9 to 91.3,76.3; area 89.5,62.3 to 96.9,69.6; area 89.5,62.3 to 96.9,69.5

### Footprints (pad centres in the part's own frame; a part is rotated, then mirrored left to right if it is on the bottom)
0603 = smd 1.1 x 1: 1 -0.85,0; 2 0.85,0
0805 = smd 0.8 x 1.2: 1 -0.9,0; 2 0.9,0
SMD-603 = smd 0.8 x 0.8: P$1 -0.75,0; P$2 0.75,0
SOD-323 = smd 0.63 x 0.83: A 1.15,0; C -1.15,0
LED-0603@1 = smd 1 x 1: A 0,-0.877; C 0,0.877
DIO_VSMB2020X01 = smd 1.35 x 0.75: A 1.9,0; C -1.9,0
TSOP36256 = smd 0.914 x 2.286: 1 -1.905,-2.921; 2 -0.635,-2.921; 3 0.635,-2.921; 4 1.905,-2.921
TRACE_ANTENNA_2.4GHZ_25.7MM_TUNED = smd 0.46 x 0.46: ANT 0,0.23 | smd 1 x 0.46: GND -1.18,0.23; GND2 -3.38,0.23
PTC-1206 = smd 1 x 1.8: 1 -1.4,0; 2 1.4,0
KEYSTONE_2479 = drill 1 pad 1.676: + 51.15,6.15; - 51.15,18.85
SOIC127P600X170-8N = smd 1.5 x 0.65: 1 -2.7,1.905; 2 -2.7,0.635; 3 -2.7,-0.635; 4 -2.7,-1.905; 5 2.7,-1.905; 6 2.7,-0.635; 7 2.7,0.635; 8 2.7,1.905
USB-MICROB-10118192 = smd 0.35 x 1.4: D+ 0,2.65; D- -0.65,2.65; GND 1.3,2.65; ID 0.65,2.65; VBUS -1.3,2.65 | smd 1.8 x 1.9: MT1 -3.8,0; MT2 3.8,0 | smd 2.1 x 1.6: MT3 -3.1,2.54; MT4 3.1,2.54 | smd 1.9 x 1.9: P$1 -1.2,0; P$2 1.2,0
SOT23-3@1 = smd 0.8 x 0.9: 1 -0.95,-1; 2 0.95,-1; 3 0,1.1
SC70-6 = smd 0.3 x 0.66: 1 -0.65,-0.92; 2 0,-0.92; 3 0.65,-0.92; 4 0.65,0.92; 5 0,0.92; 6 -0.65,0.92
SOT23-3 = smd 0.8 x 0.9: 1 -0.95,-1; 2 0.95,-1; 3 0,1.1
SOT-23-3 = smd 0.972 x 0.8: 1 0.885,-0.95; 2 0.885,0.95; 3 -0.885,0
CUS-12_SPDT = smd 0.7 x 1.5: P$1 -2.25,1.75; P$2 0.75,1.75; P$3 2.25,1.75 | smd 1 x 0.8: P$4 -3.65,1.05; P$5 -3.65,-1.05; P$6 3.65,1.05; P$7 3.65,-1.05 | hole 0.9: -1.5,0; 1.5,0
SW_TL3340AF160QG = smd 0.2 x 0.2: 1 -1.225,0.9; 3 1.225,0.9 | smd 0.6 x 1.8: 2 0,0.9 | smd 1.3 x 0.9: S1 -1.85,-1.05; S2 1.85,-1.05 | hole 0.9: 2.125,0; -2.125,0
PS12 = drill 1 pad 2.54: P$1 -2.5,0; P$2 2.5,0
PAD.03X.05 = smd 1.27 x 1.27: P$1 0,0
QFN-28_4MM_0.4MM = smd 0.8 x 0.2: 1 -2,1.2; 2 -2,0.8; 3 -2,0.4; 4 -2,0; 5 -2,-0.4; 6 -2,-0.8; 7 -2,-1.2; 15 2,-1.2; 16 2,-0.8; 17 2,-0.4; 18 2,0; 19 2,0.4; 20 2,0.8; 21 2,1.2 | smd 0.2 x 0.8: 8 -1.2,-2; 9 -0.8,-2; 10 -0.4,-2; 11 0,-2; 12 0.4,-2; 13 0.8,-2; 14 1.2,-2; 22 1.2,2; 23 0.8,2; 24 0.4,2; 25 0,2; 26 -0.4,2; 27 -0.8,2; 28 -1.2,2 | smd 2.4 x 2.4: THERMAL 0,0
QFN48-0.4MM = smd 0.8 x 0.23: 1 -2.95,2.2; 2 -2.95,1.8; 3 -2.95,1.4; 4 -2.95,1; 5 -2.95,0.6; 6 -2.95,0.2; 7 -2.95,-0.2; 8 -2.95,-0.6; 9 -2.95,-1; 10 -2.95,-1.4; 11 -2.95,-1.8; 12 -2.95,-2.2; 25 2.95,-2.2; 26 2.95,-1.8; 27 2.95,-1.4; 28 2.95,-1; 29 2.95,-0.6; 30 2.95,-0.2; 31 2.95,0.2; 32 2.95,0.6; 33 2.95,1; 34 2.95,1.4; 35 2.95,1.8; 36 2.95,2.2 | smd 0.23 x 0.8: 13 -2.2,-2.95; 14 -1.8,-2.95; 15 -1.4,-2.95; 16 -1,-2.95; 17 -0.6,-2.95; 18 -0.2,-2.95; 19 0.2,-2.95; 20 0.6,-2.95; 21 1,-2.95; 22 1.4,-2.95; 23 1.8,-2.95; 24 2.2,-2.95; 37 2.2,2.95; 38 1.8,2.95; 39 1.4,2.95; 40 1,2.95; 41 0.6,2.95; 42 0.2,2.95; 43 -0.2,2.95; 44 -0.6,2.95; 45 -1,2.95; 46 -1.4,2.95; 47 -1.8,2.95; 48 -2.2,2.95 | smd 4.3 x 4.3: EP 0,0
SSOP20_L = smd 0.381 x 1.143: 1 -2.857,-2.68; 2 -2.223,-2.68; 3 -1.587,-2.68; 4 -0.953,-2.68; 5 -0.318,-2.68; 6 0.318,-2.68; 7 0.953,-2.68; 8 1.587,-2.68; 9 2.223,-2.68; 10 2.857,-2.68; 11 2.857,2.68; 12 2.223,2.68; 13 1.587,2.68; 14 0.953,2.68; 15 0.318,2.68; 16 -0.318,2.68; 17 -0.953,2.68; 18 -1.587,2.68; 19 -2.223,2.68; 20 -2.857,2.68
SOIC-8 = smd 0.61 x 1.702: 1 -1.905,-3.251; 2 -0.635,-3.251; 3 0.635,-3.251; 4 1.905,-3.251; 5 1.905,3.251; 6 0.635,3.251; 7 -0.635,3.251; 8 -1.905,3.251
CRYSTAL-SMD-3.2X2.5 = smd 1.2 x 1.1: 1 -1.175,-0.875; 2 1.175,-0.875; 3 1.175,0.875; 4 -1.175,0.875
FC-12M = smd 0.7 x 1.4: 1 -0.85,0; 2 0.85,0

### Placement (x,y rotation side)
C1  43.08,16.26 180 top
C2  43.08,17.84 0 top
C3  27.46,20.85 0 top
C4  24.78,23.84 90 top
C5  25.4,17.16 270 top
C6  47.24,43.1 0 top
C7FIVE  10.07,58.32 180 top
C8  31.13,12.8 225 top
C9  43.08,19.91 180 top
C11  10.2,68.16 0 top
C12  10.14,66.39 0 top
C13  10.1,60.29 0 top
C14  11.98,55.8 270 top
C15  13.65,55.8 270 top
C17  38.96,49.28 180 top
C18  27.46,26.38 180 top
C20  30.56,17.18 270 top
C21  37.57,17.2 270 top
C22  36.04,17.19 270 top
C23  31.81,30.7 0 top
C24  38.36,32.75 0 top
C25  42.45,25.94 90 top
C26  43.08,21.49 180 top
C27  26.91,17.17 90 top
C29  18.16,68.64 0 top
C30  24.67,62.45 0 top
C32  1.61,23.31 270 bottom
C33  3.56,20.57 180 top
C34  8,30.54 90 top
C35  9.68,30.51 90 top
D1  26.74,30.69 309.5 top
D2  20.21,25.3 129.5 top
D3  13.68,19.91 129.5 top
D4  7.15,14.52 309.5 top
D5  49.28,22.73 0 top
D6  49.28,16.38 0 top
D7  49.28,10.03 180 top
D8  49.28,3.68 0 top
D9  71.81,30.69 230.5 top
D10  78.34,25.3 230.5 top
D11  84.87,19.91 50.5 top
D12  91.4,14.52 230.5 top
D13  71.81,67.86 129.5 top
D14  78.34,73.25 309.5 top
D15  84.87,78.64 309.5 top
D16  91.4,84.03 129.5 top
D17  49.28,82.17 0 top
D18  49.28,75.82 0 top
D19  49.28,88.52 0 top
D20  49.28,94.87 0 top
D21  26.74,67.86 50.5 top
D22  20.21,73.25 50.5 top
D23  13.68,78.64 50.5 top
D24  7.15,84.03 50.5 top
D25  14.19,70.39 180 top
D26  27.84,61.5 0 top
D27  7.15,49.28 0 top
D28  91.41,49.28 0 top
D33  49.28,49.28 0 top
E1  28.7,7.45 180 top
F1  10.12,71.09 0 top
G2  75.95,31.5 0 bottom
IC1  18.25,64.43 180 top
J1  1.92,64.87 270 top
Q1  14.08,72.91 0 top
Q2  11.53,39.14 0 top
Q3  83.59,33.66 0 top
Q4  7.93,39.19 0 top
Q5  90.44,53 0 top
Q6  5.5,54.01 0 top
R1  8.16,33.88 0 top
R2  28.46,17.19 270 top
R3  31.81,33.88 180 top
R4  31.81,32.29 180 top
R5  83.57,37.83 270 top
R6  2.76,28.32 180 top
R7  11.97,33.88 0 top
R8  6.25,30.54 90 top
R9  80.04,32.66 180 top
R10  11.97,36.1 180 top
R11  9.75,42.13 180 top
R12  10.09,73.24 0 top
R13  10.17,64.46 0 top
R14  10.07,62.2 0 top
R15  24.67,60.71 0 top
R16  8.16,36.1 180 top
R17  18.52,46.49 0 top
R18  14.01,39.51 270 top
R19  18.51,48.71 0 top
R20  49.91,42.38 270 top
R21  9.75,43.88 180 top
R22  92.36,42.89 0 top
R23  92.39,45.2 0 top
R24  94.49,52.06 0 top
R25  8.77,53.08 0 top
R26  9.79,45.51 180 top
S2  1.89,74.73 270 top
S3  1.77,35.14 270 top
SP1  83.57,37.85 0 bottom
TP1  1.72,27.35 0 bottom
U1  5.88,24.64 270 top
U2  35.41,24.93 90 top
U4  19.57,56.42 90 top
U5  36.43,44.72 270 top
Y1  27.43,23.63 90 top
Y2  40.49,20.79 90 top

### Tracks (layer width: path | path; a pad name or v marks a point on that pad's centre or on a via)
3.3V  (via drill 0.35)
  Top 0.152: R19.2 20.86,48.71 20.86,48.16 | 16.8,36.26 12.98,36.26 R10.1 12.82,34.99 | R1.2 10.12,34.99 12.82,34.99 | 12.82,34.99 R7.2 | v14.86,44.57 14.3,45.13 12.43,45.13 12.05,45.51 R26.1
  Top 0.203: C34.1 6.68,28.37 U1.2
  Top 0.229: U2.1 33.21,21.82 32.26,21.82 v31.48,21.04 30.63,20.2 30.63,18.1 C20.1 | U2.43 31.56,24.73 31.27,25.02 v30.64,25.02 | U2.19 v40.82,25.13 | U2.46 31.58,23.53 31.23,23.19 v30.64,23.19 | U2.3 34.01,21.45 34.1,21.36 34.41,21.36 U2.4 34.41,20.56 35.72,19.26 35.72,18.36 C22.1 36.08,18 37.53,18 | 31.08,30.82 31.08,28.2 v31.63,27.65 32.15,27.13 U2.37 | 31.08,30.82 C23.1 | R3.2 31.08,33.76 31.08,32.4 | 31.08,32.4 31.08,30.82 | R4.2 31.08,32.4 | v38.64,18 37.53,18 | C21.1 37.53,18
  Top 0.254: SP1.P$1 85.23,38.68 R5.1 81.47,40.78 v81.48,40.78 | R20.2 50.23,41.21 50.23,34.35 v46.89,31.02 43.88,28 43.88,25.57 43.45,25.13 42.45,25.13 | v30.64,25.02 29.28,26.38 C18.1 | v40.82,25.13 42.45,25.13 | C25.1 42.45,25.13
  Top 0.305: C34.1 9.65,29.69 C35.1 v10.86,29.66 11.88,29.66 16.8,34.58 16.8,36.26 16.8,41.94 v18.79,43.92 20.86,45.99 20.86,48.16 20.86,49.59 23.82,52.55 R15.1 C30.1 23.75,62.52 IC1.1 | R23.1 88.1,45.2 86.07,43.17 SP1.P$1
  Bottom 0.152: v14.86,44.57 18.13,44.57 v18.79,43.92
  Bottom 0.254: v81.48,40.78 64.75,40.78 54.99,31.02 v46.89,31.02
  Bottom 0.305: v30.64,23.19 v30.64,25.02 30.64,25.87 31.63,26.86 v31.63,27.65 38.3,27.65 v40.82,25.13 40.82,22.88 38.64,20.7 v38.64,18 | v30.64,23.19 17.33,23.19 v10.86,29.66 | v30.64,23.19 30.64,21.88 v31.48,21.04
3.3V_F
  Top 0.152: C7FIVE.1 11.27,57.97 15.75,57.97 | 15.75,57.97 16.85,57.97 U4.13 17.94,58 21.12,54.83 U4.3 | U4.14 15.75,57.37 15.75,57.97
26M_N
  Top 0.152: U2.44 30.17,24.33 29.78,23.94 27.43,23.94 Y1.3 26.44,24.69 C4.2
26M_P
  Top 0.152: U2.45 30.42,23.93 29.26,22.77 28.63,22.77 Y1.1 C3.2
32K_XN
  Top 0.152: C26.2 42.09,21.64 Y2.2 40.17,21.64 39.7,21.16 38.81,21.16 38.36,21.61 U2.13
32K_XP
  Top 0.152: U2.12 37.61,21.7 38.58,20.73 39.38,20.73 40.17,19.94 Y2.1 42.2,19.94 C9.2
36
  Top 0.152: U2.5 34.81,20.72 36.1,19.43 38.16,19.43 41.08,16.51 41.98,16.51 C1.2
37
  Top 0.152: U2.6 35.21,20.86 36.32,19.75 38.32,19.75 41.05,17.02 41.66,17.02 | 41.66,17.02 | 41.66,17.02 43.17,17.02 C1.1
38
  Top 0.152: U2.7 35.61,21.03 36.59,20.05 38.49,20.05 40.7,17.84 C2.1
39
  Top 0.152: U2.8 36.01,21.18 36.84,20.36 38.66,20.36 40.39,18.64 43.14,18.64 C2.2
ACC_INT
  Top 0.152: U2.14 39.05,23.13 39.6,22.59 43.23,22.59 45.47,24.83 45.47,26.34 51.26,32.13 51.26,46.28 D33.4
AUDIO_IN
  Bottom 0.152: TP1.P$1 1.74,27.33 1.74,24.29 C32.1
BUZZER_OUT  (via drill 0.35)
  Top 0.152: v77.19,32.73 79.11,32.73 R9.2 | U2.34 34.01,31.45 33.8,31.66 v33.8,32.29
  Bottom 0.152: v77.19,32.73 69.41,32.73 67.01,30.33 38.62,30.33 36.66,32.29 v33.8,32.29
CA1  (via drill 0.35, 0.35 pad 0.23)
  Top 0.152: v50.01,78.77 50.01,82.15 D17.P$2 59.03,82.17 D13.P$2 69.98,67.3 69.98,31.2 D9.P$2 65.07,22.73 D5.P$2 50.03,27.89 v50.05,27.92 | U1.21 7.08,22.03 7.71,21.4 7.71,20.1 6.35,18.75 6.35,15.68 6.67,15.36 D4.P$1 10.33,18.16 12.68,18.16 D3.P$1 D2.P$1 D1.P$2 27.31,30.02 v29.65,30.02 | D21.P$2 v28.47,69.94
  Bottom 0.152: v28.47,69.94 37.3,78.77 v50.01,78.77 | v29.65,30.02 30.76,28.91 45.51,28.91 46.51,27.92 v50.05,27.92
CA2  (via drill 0.35, 0.35 pad 0.23)
  Top 0.152: v51.1,79.68 51.1,76.89 D18.P$2 50.03,72.09 29.91,51.98 v29.91,40.55 | D14.P$2 v80.34,74.02 v80.34,74.03 | U1.22 7.88,21.74 10.82,18.8 v12.25,18.8 17.53,23.15 17.53,24.04 D2.P$2 21.12,26.93 D1.P$1 v27.47,32.24 | D8.P$1 48.53,8.53 D7.P$1 50.09,10.09 v50.09,15.07 50.09,16.32 D6.P$2 70.64,16.38 D10.P$2 | D22.P$2 v21.93,75.39
  Bottom 0.152: v50.09,15.07 47.42,15.07 45.62,16.87 14.18,16.87 v12.25,18.8 | v80.34,74.03 74.69,79.68 v51.1,79.68 26.21,79.68 v21.93,75.39 | v27.47,32.24 27.47,33.78 27.21,34.04 27.21,37.85 v29.91,40.55
CA3  (via drill 0.35)
  Top 0.152: D5.P$1 48.53,16.41 | 48.53,16.41 D6.P$1 v48.53,11.49 D7.P$2 | U1.23 8.52,23.84 8.75,23.6 8.75,21.38 10.72,19.41 11.86,19.41 D3.P$2 v14.03,21.18 16.57,23.24 16.57,24.51 v23.24,29.91 | D11.P$2 v87.46,18.74 D12.P$1 | v50,85.31 50,88.49 D19.P$2 | D23.P$2 14.32,79.05 v17.3,76.74 | D15.P$2 v87.61,79.84 | v46.74,17.32 47.64,16.41 48.53,16.41
  Bottom 0.152: v87.61,79.84 80.83,79.84 75.36,85.31 v50,85.31 25.9,85.31 17.33,76.74 v17.3,76.74 17.3,53.56 25.94,44.92 25.94,32.61 v23.24,29.91 | v14.03,21.18 17.89,17.32 v46.74,17.32 | v87.46,18.74 84.56,15.84 74.74,15.84 70.39,11.49 v48.53,11.49
CA4  (via drill 0.35)
  Top 0.152: U1.24 8.75,24.24 9.36,23.63 v9.36,21.73 | D12.P$2 88.15,16.23 D11.P$1 84.31,19.4 | 84.31,19.4 79.84,13.99 79.81,13.95 v55.37,13.95 50.03,8.61 D8.P$2 | 84.31,19.4 82.3,21.26 82.45,22.88 D10.P$1 D9.P$1 70.55,32.71 70.55,66.9 73.41,69.28 73.41,71.85 75.89,73.86 87.06,83.09 89.12,83.09 D16.P$2 89.34,86.51 81.89,86.51 72.14,96.27 50.03,96.27 | D24.P$2 14.76,84.61 26.42,96.27 50.03,96.27 | D20.P$2 50.03,96.27 | v11.64,17.41 D4.P$2
  Bottom 0.152: v9.36,21.73 9.36,19.7 v11.64,17.41 12.6,16.46 44.96,16.46 47.47,13.95 v55.37,13.95
CA5  (via drill 0.35)
  Top 0.152: U1.25 9.12,24.64 18.76,34.28 28,34.28 29.62,35.89 v29.62,35.91 | v71.38,55.89 71.38,66.38 D13.P$1 74.68,69.44 74.68,71.03 D14.P$1 D15.P$1 86.74,81.19 89.12,81.19 D16.P$1
  Bottom 0.152: v71.38,55.89 51.39,35.91 v29.62,35.91
CA6
  Top 0.152: D20.P$1 D19.P$1 D17.P$1 D18.P$1 48.53,71.72 29.2,52.4 29.2,36.54 27.51,34.85 18.72,34.85 8.9,25.04 U1.26
CA7
  Top 0.152: U1.27 8.6,25.44 18.56,35.4 27.46,35.4 28.48,36.42 28.64,36.58 28.64,65.26 D21.P$1 D22.P$1 D23.P$1 D24.P$1
CAP_10N
  Top 0.152: C27.1 28.43,16.31 R2.2 29.6,17.48 29.6,20.19 32.14,22.73 U2.48 | C27.1 C5.2 | C27.1
CHIP_PU  (via drill 0.35)
  Top 0.152: U2.9 36.41,21.35 36.8,20.96 v37.25,20.96 | S3.2 4.07,35.14 4.61,34.61 v5.84,34.61 | v5.84,34.61 5.84,38.07 6.89,39.12 11.97,39.12 12.18,38.91 Q2.3 | R1.1 6.58,34.61 v5.84,34.61
  Bottom 0.152: v5.84,34.61 5.84,32.45 18.12,20.17 36.45,20.17 v37.25,20.96
D+
  Top 0.152: J1.D+ 6.55,64.87 R14.1 9.25,62.17 C13.1
D-
  Top 0.152: J1.D- 6.99,65.52 7.86,66.39 C12.1 9.29,64.49 R13.1
DST  (via drill 0.35)
  Top 0.152: U2.15 39.12,23.53 39.43,23.21 v40.04,23.21 | U1.4 5.88,27.96 5,28.83 v5,29.79 5,32.15 5.62,32.77 10.01,32.77 R7.1
  Bottom 0.152: v5,29.79 7.65,29.79 17.72,19.71 37.01,19.71 37.97,20.68 37.97,21.15 v40.04,23.21
DTR
  Top 0.152: U4.1 20.71,53.56 17.66,50.51 R19.1 17.66,46.5 R17.1 17.67,45.53 15.03,42.88 15.03,38.05 14.03,37.05 11.49,37.05 10.88,37.66 Q2.1
FLASH_SCK  (via drill 0.35)
  Top 0.152: U2.31 35.21,35.31 32.75,37.77 32.75,40.09 v32.69,40.15 | v37.45,43.15 38.39,44.09 U5.6
  Bottom 0.152: v32.69,40.15 34.45,40.15 v37.45,43.15
FLASH_SCS  (via drill 0.35)
  Top 0.152: U2.30 35.61,35.86 33.56,37.91 v33.56,40.81 | v34.67,46.58 33.23,46.58 U5.1
  Bottom 0.152: v33.56,40.81 33.56,45.47 v34.67,46.58
FLASH_SDI  (via drill 0.35)
  Top 0.152: U5.5 38.12,42.82 v36.9,41.6 | U2.33 34.41,34.53 31.29,37.66 v31.29,39.22
  Bottom 0.152: v36.9,41.6 34.52,39.22 v31.29,39.22
FLASH_SDO
  Top 0.152: U5.2 31.97,45.36 31.6,44.99 31.6,40.31 32.08,39.84 32.08,37.7 34.81,34.97 U2.32
FLASH_SHD
  Top 0.152: U2.28 36.41,37.15 41.25,41.99 41.25,44.31 40.2,45.36 U5.7
FLASH_SWP
  Top 0.152: U2.29 36.01,42.99 34.91,44.09 U5.3
FLASH_VDD
  Top 0.229: U2.26 37.21,32.45 C24.1 37.19,33.07 37.19,36.88 41.92,41.61 41.92,44.94 40.23,46.63 U5.8 39.71,46.66 39.71,49.17 C17.1
GND  (via drill 0.35)
  Top 0.203: U1.18 U1.THERMAL 5.48,25.04 U1.5
  Top 0.965: E1.GND 29.88,8.64 32.08,8.64 E1.GND2
  other vias: 33.88,26.26 5.19,23.98 5.25,25.26 6.56,25.26 6.48,24 35.38,26.25 36.99,26.28 33.85,24.5 36.95,24.67 35.4,24.57 33.85,23.45 35.41,23.42 36.97,23.4 24.82,21.8 25.35,20.9 4.98,35.72 4.98,33.85 3.14,22.03 29.5,24.9 1.33,8 2.6,8 3.87,8 5.14,8 6.41,8 7.68,8 8.95,8 10.22,8 11.49,8 12.76,8 14.03,8 15.3,8 16.57,8 17.84,8 1.97,9.27 3.24,9.27 4.51,9.27 5.78,9.27 7.05,9.27 8.32,9.27 9.59,9.27 10.86,9.27 12.13,9.27 13.4,9.27 14.67,9.27 15.94,9.27 17.21,9.27 18.48,9.27 19.11,8 20.38,8 21.65,8 22.92,8 24.19,8 25.46,8 26.73,8 30.54,8 31.81,8 33.08,8 34.35,8 35.62,8 33.08,8 34.35,8 35.62,8 36.89,8 38.16,8 39.43,8 40.7,8 41.97,8 43.24,8 44.51,8 45.78,8 47.05,8 19.75,9.27 21.02,9.27 22.29,9.27 23.56,9.27 24.83,9.27 26.1,9.27 27.37,9.27 29.91,9.27 31.18,9.27 32.45,9.27 33.72,9.27 34.99,9.27 36.26,9.27 37.53,9.27 38.8,9.27 40.07,9.27 41.34,9.27 42.61,9.27 43.88,9.27 45.15,9.27 46.42,9.27 30.7,10.54 27.69,10.7 28.48,12.13 29.75,13.4 31.97,11.65 33.24,12.92 34.19,14.19 34.67,15.78 31.02,14.51 32.29,15.78 34.67,18.95 32.61,18.95 32.77,29.59 39.12,34.04 21.02,30.38 15.94,26.26 8,18.64 8.79,27.21 32.61,20.86 36.1,15.14 37.53,15.14 45.15,21.49 45.15,19.91 42.45,28 25.3,26.42 34.83,42.77 34.67,18 32.61,18
  pour Top (isolate 0.152, rank 2): -2.07,7.55 101.19,7.55 101.19,101.26 -2.07,101.26
  pour Bottom (isolate 0.152, rank 2): -1.68,100.41 105.32,100.41 105.32,7.57 -5.49,7.57 -5.49,99.14
GPIO-0  (via drill 0.35)
  Top 0.152: U2.23 38.98,26.73 39.89,27.65 39.89,29.21 v39.5,29.6 | v28.97,32.72 28.84,32.85 27.22,32.85 27.16,32.8 20.47,32.8 19.61,31.94 v19.61,31.86 | v5.5,40.99 6.37,40.11 Q4.6
  Bottom 0.152: v39.5,29.6 34.12,29.6 31,32.72 v28.97,32.72 | v19.61,31.86 10.49,40.99 v5.5,40.99
IR_OUT  (via drill 0.35)
  Top 0.152: v19.49,39.79 24.85,39.79 v27.86,36.78 | U2.24 38.32,27.13 v38.32,31.69 | v89.37,42.81 91.43,42.81 R22.1 | v13.88,43.72 10.76,43.72 R21.1
  Bottom 0.152: v27.86,36.78 29.46,35.18 34.83,35.18 v38.32,31.69 54.51,31.69 65.64,42.81 v89.37,42.81 | v19.49,39.79 15.56,43.72 v13.88,43.72
LEDS_SDB  (via drill 0.35)
  Top 0.152: U2.39 31.69,26.33 30.44,27.58 v30.13,28.21 | U1.3 6.28,29.67 R8.1 7.1,30.54 v11.39,30.54
  Bottom 0.152: v30.13,28.21 29.5,27.59 14.33,27.59 11.39,30.53 v11.39,30.54
LNA_IN
  Top 0.203: U2.2 33.61,20.86
  Top 0.762: C8.1 32.87,14.54 arc45 33.61,16.34 33.61,20.86
N$1
  Top 0.152: U1.16 5.08,21.84 4.66,21.42 4.66,20.83 C33.1
N$2
  Top 0.152: U1.6 5.08,27.49 4.57,28 3.93,28 R6.1
N$3
  Top 0.152: Q3.3 83.59,36.96 R5.2 81.93,36.98 SP1.P$2
N$4
  Top 0.152: C27.2 28.44,18.02 R2.1 29.29,18.86 29.29,20.59 31.83,23.13 U2.47
N$5
  Top 0.152: Q6.1 6.39,53.08 R25.1 7.13,52.29 7.13,44.42 7.67,43.88 R21.2
N$6
  Top 0.152: R24.1 91.34,52.06 Q5.1 92.32,51.05 94.18,51.05 94.88,50.35 94.88,43.4 94.37,42.89 R22.2
N$7
  Top 0.152: R13.2 11.94,64.46 16.2,60.2 17.53,60.2 18.03,59.69 18.03,58.93 17.74,58.64 U4.12
N$8
  Top 0.152: R14.2 12.19,62.2 15.11,59.27 U4.11
N$9
  Top 0.152: Q4.2 7.93,36.72 R16.2
N$10  (via drill 0.35)
  Top 0.152: R17.2 15.82,42.94 v15.82,41.23 | v12.09,41.23 11.53,40.67 Q2.5
  Bottom 0.152: v15.82,41.23 v12.09,41.23
N$11  (via drill 0.35)
  Top 0.152: U1.17 5.48,21.68 5.32,21.53 5.32,19.54 5.08,19.3 v1.52,19.3
  Bottom 0.152: v1.52,19.3 1.52,22.37 C32.2
N$12
  Top 0.152: Q2.2 11.53,37.97 11.97,37.53 12.89,37.53 R18.2
N$13
  Top 0.152: R10.2 10.96,36.26 9.17,36.26 R16.1 8.58,36.53 Q4.3
N$14
  Top 0.152: R11.2 7.93,41.16 Q4.5
N$15
  Top 0.152: R11.1 10.88,42.13 Q2.6
N$16  (via drill 0.35)
  Top 0.508: S2.P$2 5.29,73.98 v5.95,73.32
  Bottom 0.508: v5.95,73.32 5.95,63.87 24.8,45.02 G2.+
N$17
  Top 0.254: D33.3 50.07,46.2 50.07,43.39 R20.1 48.22,43.23 C6.2
N$18
  Top 0.152: R15.2 27.76,60.71 D26.A
N$19
  Top 0.152: Q5.3 89.55,49.32 D28.C
N$20
  Top 0.152: 93.31,45.27 R23.2
  Top 0.305: D28.A 93.31,45.27
N$21
  Top 0.152: Q6.3 4.61,52.09 5.26,51.44 5.26,49.29 D27.C
N$22
  Top 0.152: D27.A 9.05,45.62 R26.2
N$26
  Top 0.152: R9.1 Q3.1
RTS
  Top 0.152: Q2.4 13.72,40.06 R18.1 14.02,42.69 16.69,45.36 16.69,50.48 20.44,54.23 22.21,54.23 U4.2
SCL  (via drill 0.35)
  Top 0.152: U1.20 6.68,21.57 v7.1,21.15 | U2.35 33.61,31.34 R4.1 33.56,33.19 33.56,34.67 33.08,35.15 29.75,35.15 28.48,33.88 19.27,33.88 v10.38,24.99
  Bottom 0.152: v7.1,21.15 8.06,22.11 8.06,22.61 10.38,24.94 v10.38,24.99
SDA  (via drill 0.35)
  Top 0.152: v10.11,23.8 19.69,33.39 28.67,33.39 29.96,34.67 31.87,34.67 R3.1 31.86,33.07 31.86,28.44 32.42,27.88 U2.36 | U1.19 6.28,20.41 6.59,20.1 v6.59,20.07
  Bottom 0.152: v6.59,20.07 7.25,20.07 8.52,21.31 8.52,22.22 v10.11,23.8
T_DOWN  (via drill 0.35)
  Top 0.152: U2.18 39.76,24.75 40.31,24.2 43.41,24.2 44.51,25.3 44.51,27.53 v49.59,32.61
  Bottom 0.152: 87.26,57.51 87.27,57.5 87.27,57.49 78.96,57.49 54.07,32.61 v49.59,32.61
  pour Bottom: 91.04,58.55 91.04,59.46 arc90 87.73,62.77 87.41,62.77 arc90 83.77,59.14 83.77,55.38 90.99,55.38 90.99,58.49 91.01,58.49 91.01,58.54 91.03,58.54
  pour Bottom: 91.04,58.55 91.04,59.46 arc90 87.73,62.77 87.41,62.77 arc90 83.77,59.14 83.77,55.38 90.99,55.38 90.99,58.49 91.01,58.49 91.01,58.54 91.03,58.54
T_LEFT  (via drill 0.35)
  Top 0.152: v40.98,34.7 40.35,34.06 40.35,27.49 39.19,26.33 U2.22 | v88.33,65.9 88.33,65.88 81.87,59.41 77.58,59.41 v72.98,54.81
  Bottom 0.152: v40.98,34.7 41,34.71 51.56,34.71 71.66,54.81 v72.98,54.81 | v88.33,65.9 90.33,65.9 90.97,65.26 93.11,65.26
  pour Bottom: 93.65,69.55 92.74,69.55 arc90 89.43,66.24 89.43,65.92 arc90 93.06,62.29 96.82,62.29 96.82,69.5 93.71,69.5 93.71,69.52 93.67,69.52 93.67,69.55
  pour Bottom: 93.65,69.55 92.74,69.55 arc90 89.43,66.24 89.43,65.92 arc90 93.06,62.29 96.82,62.29 96.82,69.5 93.71,69.5 93.71,69.52 93.67,69.52 93.67,69.55
  pour Bottom: 93.73,69.39 92.82,69.39 arc90 89.51,66.08 89.51,65.76 arc90 93.14,62.13 96.89,62.13 96.89,69.34 93.78,69.34 93.78,69.37 93.74,69.37 93.74,69.39
  pour Bottom: 93.73,69.55 92.82,69.55 arc90 89.51,66.24 89.51,65.92 arc90 93.14,62.29 96.89,62.29 96.89,69.5 93.78,69.5 93.78,69.52 93.74,69.52 93.74,69.55
T_RIGHT  (via drill 0.35)
  Top 0.152: U2.20 39.94,25.53 41.46,27.05 41.46,31.66 v43.05,33.25
  Bottom 0.152: 81.04,64.71 80.98,64.65 80.98,60.99 53.24,33.25 v43.05,33.25
  pour Bottom: 81.47,62.21 82.38,62.21 arc90 85.69,65.52 85.69,65.85 arc90 82.06,69.48 78.31,69.48 78.31,62.27 81.42,62.27 81.42,62.24 81.46,62.24 81.46,62.22
  pour Bottom: 81.49,62.21 82.08,62.21 arc90 85.71,65.85 arc90 82.08,69.48 78.32,69.48 78.32,62.27 81.43,62.27 81.43,62.24 81.47,62.24 81.47,62.22
T_SELECT  (via drill 0.35)
  Top 0.152: U2.17 39.61,24.33 40.07,23.88 43.72,23.88 44.99,25.15 44.99,27.05 v46.74,28.8
  Bottom 0.152: 89.51,26.07 84.53,31.05 69.12,31.05 66.86,28.8 v46.74,28.8
  pour Bottom (isolate 0.381): 89.58,32.45 arc-90 95.93,26.1 arc-90 89.58,19.75 arc-90 83.23,26.1 arc-90
T_UP  (via drill 0.35)
  Top 0.152: v42.03,34.01 40.91,32.9 40.91,27.3 39.54,25.93 U2.21 | v82.58,73.62 80.15,71.18 78.49,71.18 72.11,65.6 v72.11,53.84
  Bottom 0.152: v42.03,34.01 52.3,34.01 72.11,53.82 v72.11,53.84 | v82.58,73.62 87.36,73.62 87.39,73.59 87.42,73.62 87.42,73.64
  pour Bottom: 84.05,73.17 84.05,72.26 arc90 87.36,68.95 87.68,68.95 arc90 91.31,72.59 91.31,76.34 84.1,76.34 84.1,73.23 84.07,73.23 84.07,73.19 84.05,73.19
  pour Bottom: 84.05,73.17 84.05,72.26 arc90 87.36,68.95 87.68,68.95 arc90 91.31,72.59 91.31,76.34 84.1,76.34 84.1,73.23 84.07,73.23 84.07,73.19 84.05,73.19
TRACE_ANT
  Top 0.508: E1.ANT 28.7,7.89
  Top 0.762: 28.7,7.89 28.7,9.32 arc-45 29.44,11.12 C8.2
U0RXD  (via drill 0.35)
  Top 0.152: U2.40 31.51,25.93 v29.09,28.35 | U4.20 16.92,53.53 v18.21,53.53
  Bottom 0.152: v29.09,28.35 27.82,28.35 26.36,29.81 26.36,45.37 v18.21,53.53
U0TXD  (via drill 0.35)
  Top 0.152: v28.16,29.1 28.16,28.43 31.05,25.53 U2.41 | U4.4 21.41,55.46 v20.96,55.92
  Bottom 0.152: v28.16,29.1 26.78,30.48 26.78,45.81 20.96,51.63 v20.96,55.92
V_BATT
  Top 0.254: S2.P$1 4.08,76.98
  Top 0.508: Q1.3 14.08,75.08 10.67,78.49 5.59,78.49 4.08,76.98
V_USB  (via drill 0.35)
  Top 0.152: F1.2 11.57,71.03 11.57,71.63
  Top 0.254: R12.2 11.25,72.92 11.25,71.79 | 11.57,71.79 11.57,71.63 | F1.2 11.68,70.92 11.68,70.36 11.87,70.55 | Q1.1 13.01,71.79 | 13.05,70.37 D25.A
  Top 0.305: U4.15 v14.99,56.73 13.73,56.73 | 13.05,70.37 v13.05,69.09 | 13.73,56.73 C15.1 | C14.1 12.06,56.73 13.73,56.73
  Top 0.406: D25.A 12.88,70.55 11.87,70.55 | 13.01,71.79 11.57,71.79 11.25,71.79
  Bottom 0.305: v14.99,56.73 14.99,67.15 v13.05,69.09
VIN
  Top 0.254: 17.27,68.65 C29.1 | D25.C 15.24,70.48
  Top 0.406: D25.C 16.74,70.39 17.27,69.85 17.27,68.65 | C29.1 17.26,67.06 17.26,66.8 17.26,66.33 | 17.26,66.33 17.26,63.01 16.77,62.52 IC1.8 | IC1.5 17.26,66.33 | Q1.2 15.24,71.69 15.24,70.48
VUSB-RAW
  Top 0.406: J1.VBUS 5.97,66.17 7.96,68.16 C11.1 9.35,69.14 8.72,69.77 F1.1

### Text on the board
bPlace: ON | OFF | RESET
Reference: 39.52
tDocu: Transmitter | Transmitter | Receiver | Receiver | Transmitter | Transmitter